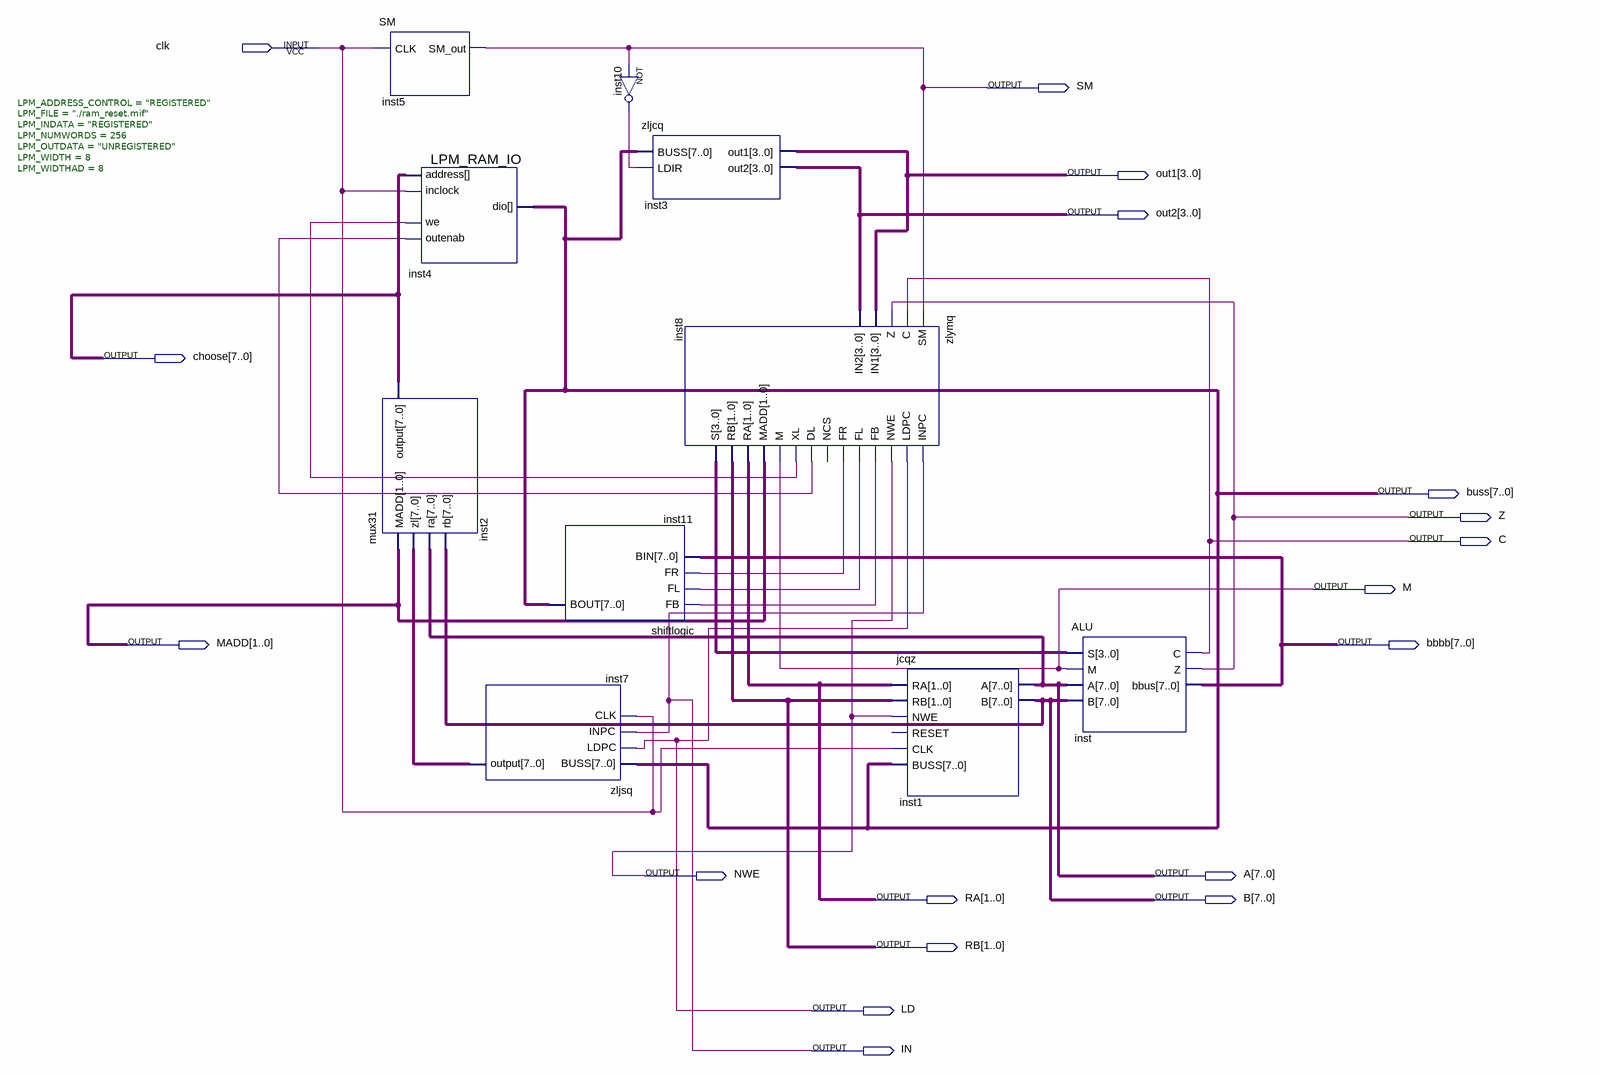
[diagram p0: schematic sheet]
// Quartus schematic MAIN.bdf as structural Verilog: 10 symbols, 18 pins
module MAIN (
  input  clk,
  output SM,
  output [3:0] out1,
  output [3:0] out2,
  output [7:0] choose,
  output [7:0] buss,
  output Z,
  output C,
  output M,
  output [1:0] MADD,
  output [7:0] bbbb,
  output NWE,
  output [7:0] A,
  output [1:0] RA,
  output [7:0] B,
  output [1:0] RB,
  output LD,
  output IN
);

  wire inst8_dl, inst8_fb, inst8_fl, inst8_fr, inst8_xl, inst10_out;
  wire [3:0] inst8_s;
  wire [7:0] inst7_output;

  SM inst5 (.CLK(clk), .SM_out(SM));
  mux31 inst2 (.MADD(MADD), .zl(inst7_output), .ra(A), .rb(B), .\output (choose));
  LPM_RAM_IO #(.LPM_ADDRESS_CONTROL("REGISTERED"), .LPM_FILE("./ram_reset.mif"), .LPM_INDATA("REGISTERED"), .LPM_NUMWORDS(256), .LPM_OUTDATA("UNREGISTERED"), .LPM_WIDTH(8), .LPM_WIDTHAD(8)) inst4 (
    .address(choose), .inclock(clk), .we(inst8_xl), .outenab(inst8_dl), .dio(buss));
  zljsq inst7 (.BUSS(buss), .LDPC(LD), .INPC(IN), .CLK(clk), .\output (inst7_output));
  shiftlogic inst11 (.FB(inst8_fb), .FL(inst8_fl), .FR(inst8_fr), .BIN(bbbb), .BOUT(buss));
  not inst10 (inst10_out, SM);
  zljcq inst3 (.BUSS(buss), .LDIR(inst10_out), .out1(out1), .out2(out2));
  zlymq inst8 (
    .SM(SM), .C(C), .Z(Z), .IN1(out1), .IN2(out2), .INPC(IN), .LDPC(LD), .NWE(NWE), .FB(inst8_fb),
    .FL(inst8_fl), .FR(inst8_fr), .DL(inst8_dl), .XL(inst8_xl), .M(M), .MADD(MADD), .RA(RA), .RB(RB),
    .S(inst8_s));  // open: NCS
  jcqz inst1 (.RA(RA), .RB(RB), .NWE(NWE), .CLK(clk), .BUSS(buss), .A(A), .B(B));  // open: RESET
  ALU inst (.S(inst8_s), .M(M), .A(A), .B(B), .C(C), .Z(Z), .bbus(bbbb));
endmodule
